# EAGLE schematic CANBus (EAGLE 9.1.3)
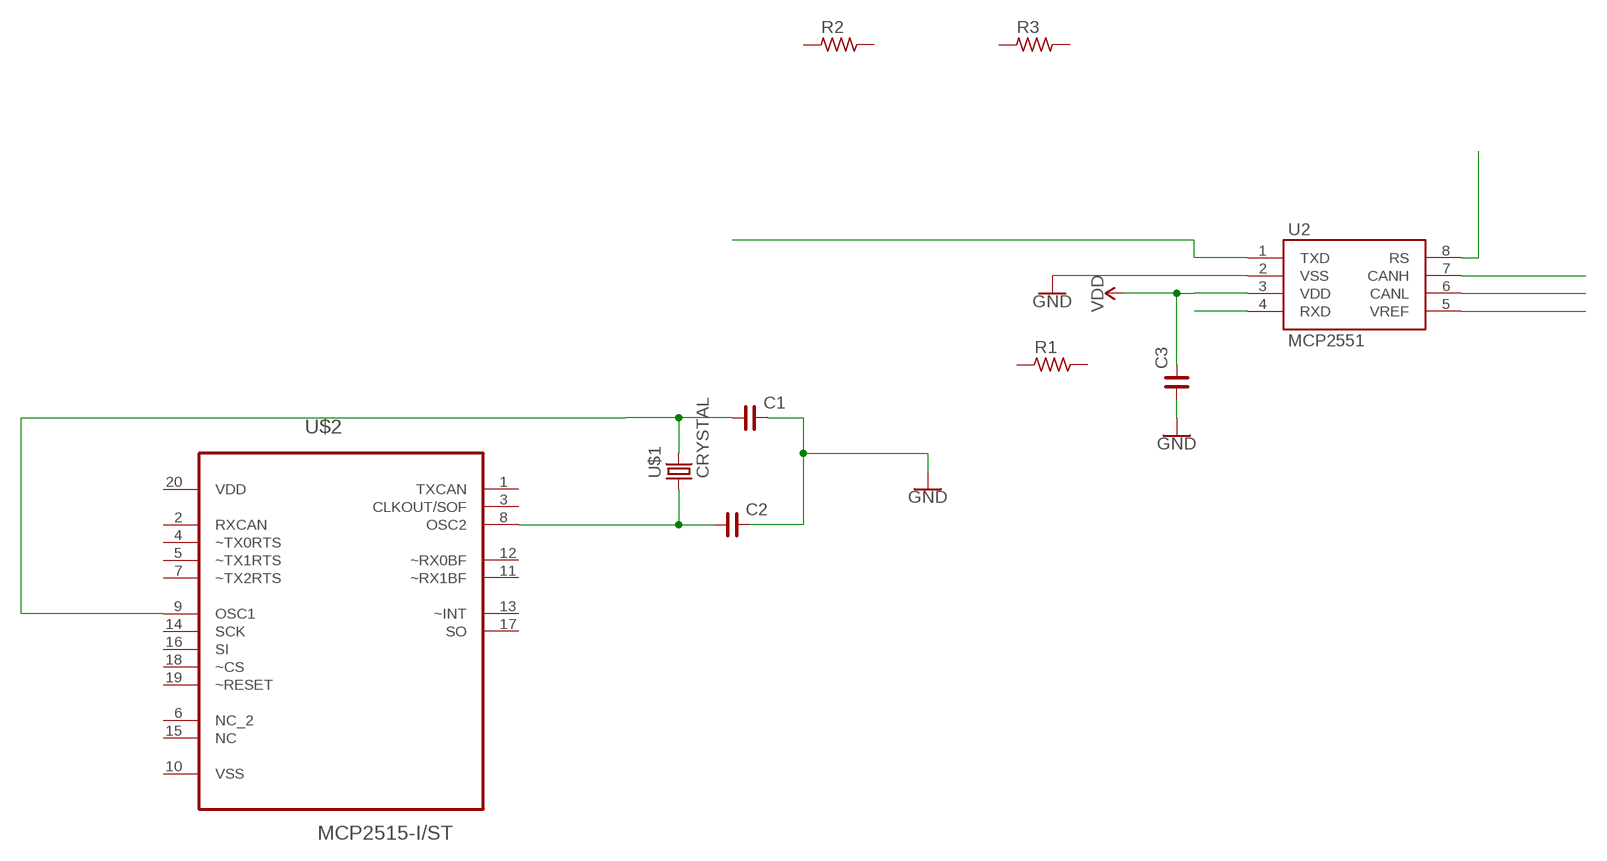
[diagram p0: schematic, sheet 1]

## Parts
C1  C_3216  [C3216]
C2  C_3216  [C3216]
C3  C_3216  [C3216]
R1  R_3216  [R3216]
R2  R_3216  [R3216]
R3  R_3216  [R3216]
U2  MCP2551  [SO08]
U$1  CRYSTAL  [2-SMD-5X3MM]
U$2  MCP2515-I/ST  [SOP65P640X110-20N]

## Nets
GND: C1.2 C2.2 C3.1 U2.2(VSS)
N$1: C1.1 U$1.P$2 U$2.9(OSC1)
N$2: C2.1 U$1.P$1 U$2.8(OSC2)
N$7: U2.8(RS)
N$8: U2.7(CANH)
N$9: U2.6(CANL)
N$10: U2.5(VREF)
N$11: U2.1(TXD)
N$14: U2.4(RXD)
VDD: C3.2 U2.3(VDD)
Unconnected: R1.1 R1.2 R2.1 R2.2 R3.1 R3.2 U$2.1(TXCAN) U$2.2(RXCAN) U$2.3(CLKOUT/SOF) U$2.4(~TX0RTS) U$2.5(~TX1RTS) U$2.6(NC_2) U$2.7(~TX2RTS) U$2.11(~RX1BF) U$2.12(~RX0BF) U$2.13(~INT) U$2.14(SCK) U$2.15(NC) U$2.16(SI) U$2.17(SO) U$2.18(~CS) U$2.19(~RESET)

## Power pins joined to a net without a drawn wire
VDD: U$2.20(VDD)
VSS: U$2.10(VSS)

## Library data of the parts
C1-C3 = rc-master-smd:C_: NON-POLARIZED CAP
R1-R3 = rc-master-smd:R_: RESISTOR
U2 = SparkFun-IC-Comms:MCP2551: MCP2551 High Speed CAN Transceiver High speed CAN transceiver Datasheet <http://www.sparkfun.com/datasheets/DevTools/Arduino/MCP2551.pdf> SparkFun Products CAN-BUS Shield <https://www.sparkfun.com/products/13262> (DEV-13262) SparkFun OBD-II UART <https://www.sparkfun.com/products/9555> (WIG-09555); PROD_ID: IC-09907
U$1 = fab:CRYSTAL
U$2 = MCP2515-I_ST:MCP2515-I/ST: Stand-Alone CAN Controller; AVAILABILITY: Unavailable; DESCRIPTION: MCP2515 Series 5.5 V 1 Mb/s Stand Alone SPI Interface CAN Controller- TSSOP-20; MF: Microchip; MP: MCP2515-I/ST; PACKAGE: TSSOP-20 Microchip; PRICE: None